# Altium project PDM_v1.0.PrjPcb
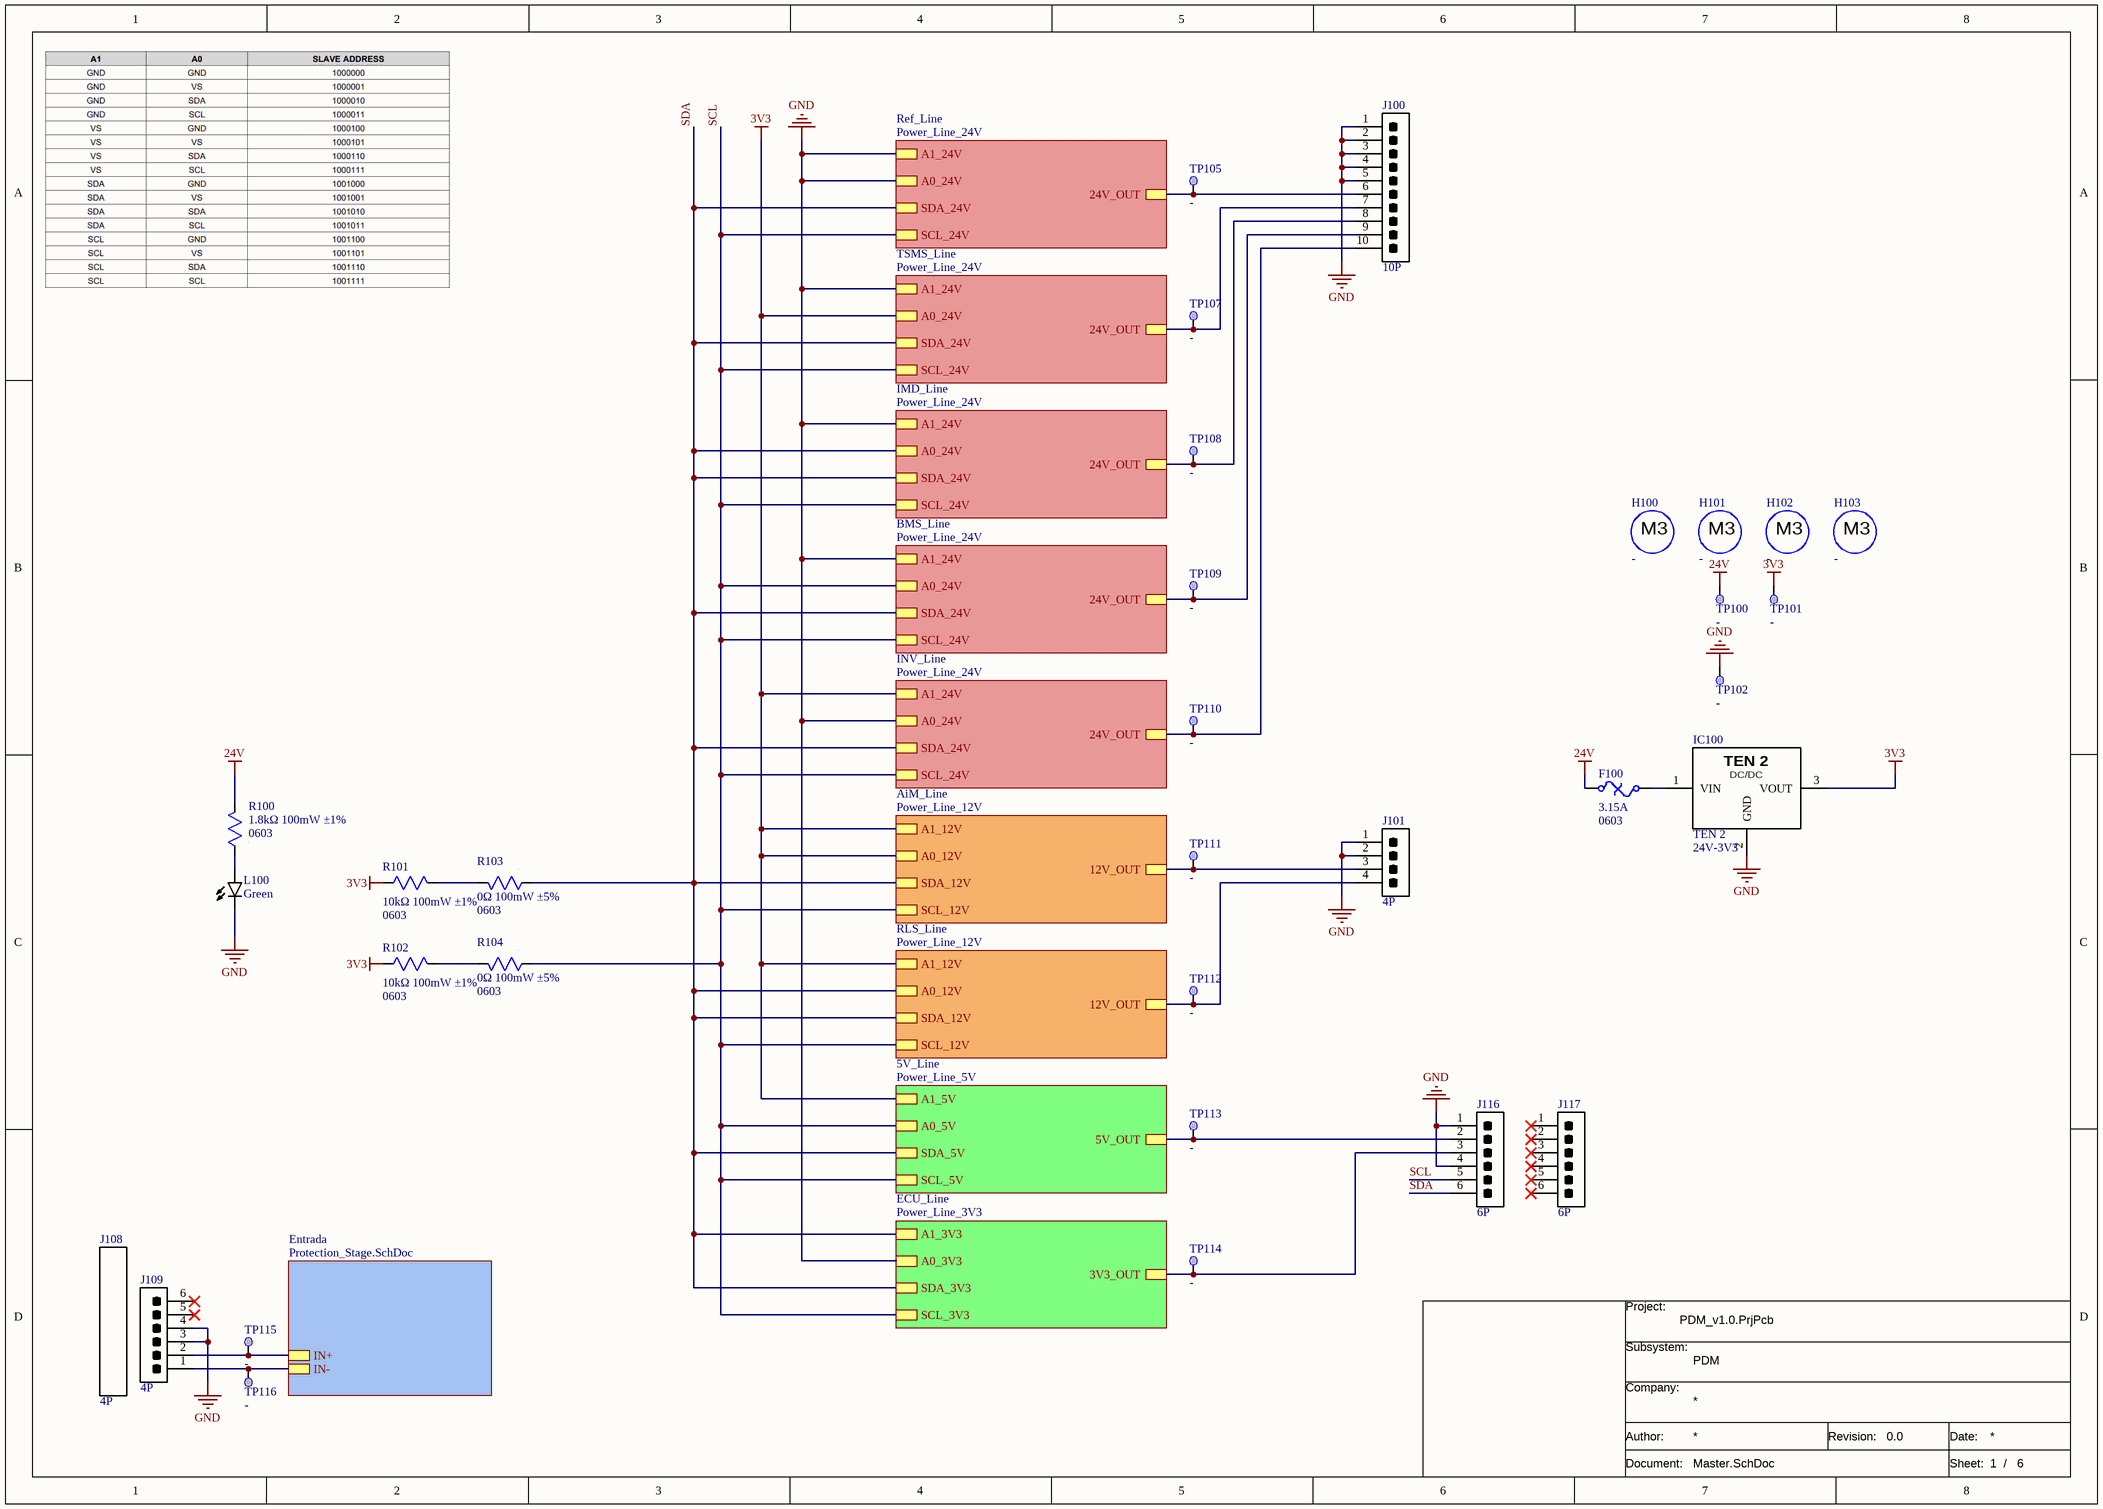
[diagram p0: Master.SchDoc]
Author: eUSRacing; Date: 07/04/2026; Project: PDM; Revision: 0.0
6 sheets, 174 parts. Net scope: hierarchical (ports join the sheet entries above them; power ports are global).
Board file: PDM.PcbDoc
Sheets:
  Master.SchDoc
    ECU_Line = Power_Line_3V3.SchDoc
    5V_Line = Power_Line_5V.SchDoc
    RLS_Line = Power_Line_12V.SchDoc
    AiM_Line = Power_Line_12V.SchDoc
    Ref_Line = Power_Line_24V.SchDoc
    IMD_Line = Power_Line_24V.SchDoc
    BMS_Line = Power_Line_24V.SchDoc
    INV_Line = Power_Line_24V.SchDoc
    Entrada = Protection_Stage.SchDoc
    TSMS_Line = Power_Line_24V.SchDoc

## Sheet Master.SchDoc: PDM
size A3; SheetNumber: 1; SheetTotal: 6

### Parts
F100  value 3.15A  Package: 0603  [FUSE SMD 0603]  (hidden comment: FUSE)
H100  SCREW M3  [M3]  (value not drawn)
H101  SCREW M3  [M3]  (value not drawn)
H102  SCREW M3  [M3]  (value not drawn)
H103  SCREW M3  [M3]  (value not drawn)
IC100  TEN 2  value 24V-3V3  [TEN 2]
J100  value 10P  [657010240101]  (hidden comment: CONN 10P)
J101  value 4P  [657004240101]  (hidden comment: CONN 4P)
J108  value 4P  [657004150201]  (hidden comment: AEREO)
J109  value 4P  [657004140101]  (hidden comment: CONN 6P)
J116  value 6P  [HEADERS_MALE_6P_2.54MM]  (hidden comment: CONN 6P)
J117  value 6P  [HEADERS_MALE_6P_2.54MM]  (hidden comment: CONN 6P)
L100  value Green  [LED SMD 0603]  (hidden comment: LED WHITE)
R100  value 1.8kΩ 100mW ±1%  Package: 0603  [RES SMD 0603]  (hidden comment: RES)
R101  value 10kΩ 100mW ±1%  Package: 0603  [RES SMD 0603]  (hidden comment: RES)
R102  value 10kΩ 100mW ±1%  Package: 0603  [RES SMD 0603]  (hidden comment: RES)
R103  value 0Ω 100mW ±5%  Package: 0603  [RES SMD 0603]  (hidden comment: RES)
R104  value 0Ω 100mW ±5%  Package: 0603  [RES SMD 0603]  (hidden comment: RES)
TP100  Test Point  [TP_SMD_1MM]  (value not drawn)  (no BOM)
TP101  Test Point  [TP_SMD_1MM]  (value not drawn)  (no BOM)
TP102  Test Point  [TP_SMD_1MM]  (value not drawn)  (no BOM)
TP105  Test Point  [TP_SMD_1MM]  (value not drawn)  (no BOM)
TP107  Test Point  [TP_SMD_1MM]  (value not drawn)  (no BOM)
TP108  Test Point  [TP_SMD_1MM]  (value not drawn)  (no BOM)
TP109  Test Point  [TP_SMD_1MM]  (value not drawn)  (no BOM)
TP110  Test Point  [TP_SMD_1MM]  (value not drawn)  (no BOM)
TP111  Test Point  [TP_SMD_1MM]  (value not drawn)  (no BOM)
TP112  Test Point  [TP_SMD_1MM]  (value not drawn)  (no BOM)
TP113  Test Point  [TP_SMD_1MM]  (value not drawn)  (no BOM)
TP114  Test Point  [TP_SMD_1MM]  (value not drawn)  (no BOM)
TP115  Test Point  [TP_SMD_1MM]  (value not drawn)  (no BOM)
TP116  Test Point  [TP_SMD_1MM]  (value not drawn)  (no BOM)

### Sub-sheets
5V_Line = Power_Line_5V: 5V_OUT, A1_5V, A0_5V, SDA_5V, SCL_5V
AiM_Line = Power_Line_12V: 12V_OUT, A1_12V, A0_12V, SDA_12V, SCL_12V
BMS_Line = Power_Line_24V: A1_24V, A0_24V, SDA_24V, SCL_24V, 24V_OUT
ECU_Line = Power_Line_3V3: 3V3_OUT, A1_3V3, A0_3V3, SDA_3V3, SCL_3V3
Entrada = Protection_Stage.SchDoc: IN-, IN+
IMD_Line = Power_Line_24V: A1_24V, A0_24V, SDA_24V, SCL_24V, 24V_OUT
INV_Line = Power_Line_24V: A1_24V, A0_24V, SDA_24V, SCL_24V, 24V_OUT
Ref_Line = Power_Line_24V: A1_24V, A0_24V, SDA_24V, SCL_24V, 24V_OUT
RLS_Line = Power_Line_12V: 12V_OUT, A1_12V, A0_12V, SDA_12V, SCL_12V
TSMS_Line = Power_Line_24V: A1_24V, A0_24V, SDA_24V, SCL_24V, 24V_OUT

### Nets
3V3: IC100.3(VOUT) R101.1 R102.1 TP101.1 ; sheet 5V_Line/A1_5V, sheet RLS_Line/A1_12V, sheet AiM_Line/A1_12V, sheet AiM_Line/A0_12V, sheet INV_Line/A1_24V, sheet TSMS_Line/A0_24V
24V: F100.1 R100.2 TP100.1
GND: IC100.2(GND) J100.1 J100.2 J100.3 J100.4 J100.5 J101.1 J101.2 J109.3 J109.4 J116.1 J116.4 L100.C TP102.1 ; sheet ECU_Line/A0_3V3, sheet Ref_Line/A1_24V, sheet Ref_Line/A0_24V, sheet IMD_Line/A1_24V, sheet BMS_Line/A1_24V, sheet INV_Line/A0_24V, sheet TSMS_Line/A1_24V
3V3_OUT: J116.3 TP114.1 ; sheet ECU_Line/3V3_OUT
5V_OUT: J116.2 TP113.1 ; sheet 5V_Line/5V_OUT
12V_OUT: J101.3 TP111.1 ; sheet AiM_Line/12V_OUT
12V_OUT: J101.4 TP112.1 ; sheet RLS_Line/12V_OUT  [a separate net that carries the same name]
24V_OUT: J100.6 TP105.1 ; sheet Ref_Line/24V_OUT
24V_OUT: J100.7 TP107.1 ; sheet TSMS_Line/24V_OUT  [a separate net that carries the same name]
24V_OUT: J100.8 TP108.1 ; sheet IMD_Line/24V_OUT  [a separate net that carries the same name]
24V_OUT: J100.9 TP109.1 ; sheet BMS_Line/24V_OUT  [a separate net that carries the same name]
24V_OUT: J100.10 TP110.1 ; sheet INV_Line/24V_OUT  [a separate net that carries the same name]
IN+: J109.2 TP115.1 ; sheet Entrada/IN+
IN-: J109.1 TP116.1 ; sheet Entrada/IN-
SCL: J116.5 R104.1 ; sheet ECU_Line/SCL_3V3, sheet 5V_Line/A0_5V, sheet 5V_Line/SCL_5V, sheet RLS_Line/SCL_12V, sheet AiM_Line/SCL_12V, sheet Ref_Line/SCL_24V, sheet IMD_Line/SCL_24V, sheet BMS_Line/A0_24V, sheet BMS_Line/SCL_24V, sheet INV_Line/SCL_24V, sheet TSMS_Line/SCL_24V
SDA: J116.6 R103.1 ; sheet ECU_Line/A1_3V3, sheet ECU_Line/SDA_3V3, sheet 5V_Line/SDA_5V, sheet RLS_Line/A0_12V, sheet RLS_Line/SDA_12V, sheet AiM_Line/SDA_12V, sheet Ref_Line/SDA_24V, sheet IMD_Line/A0_24V, sheet IMD_Line/SDA_24V, sheet BMS_Line/SDA_24V, sheet INV_Line/SDA_24V, sheet TSMS_Line/SDA_24V
NetF100_2: F100.2 IC100.1(VIN)
NetL100_A: L100.A R100.1
NetR101_2: R101.2 R103.2
NetR102_2: R102.2 R104.2

Not connected (* = marked no-connect by the designer): J109 5* 6*; J117 1* 2* 3* 4* 5* 6*

### Notes on the sheet
- Project:
- Subsystem:
- Company:
- Document:
- Author:
- Revision:
- Date:
- Sheet:
- /
- (in symbol 070-0001) DC/DC
- (in symbol 100-0002) M3

### Library data of the parts
F100 = 040-0025: Surface Mount Fuses 3.15A Slow Blow 0603 SinglFuse; MPN: SF-0603S315-2; Manufacturer: Bourns; ComponentLink1Description: Datasheet; ComponentLink1URL: https://www.mouser.es/datasheet/3/40/1/sf0603s.pdf; ComponentLink2Description: Distributor Link; ComponentLink2URL: https://www.mouser.es/en/ProductDetail/Bourns/SF-0603S315-2?qs=GIQXYiEeHGBW8r%252BkbDjk9Q%3D%3D; ID: 040-0025; Distributor PN: 652-SF-0603S315-2; Distributor: Mouser
H100-H103 = 100-0002: M3 Screw; ComponentLink1Description: Datasheet; ComponentLink1URL: -; ComponentLink2Description: Distributor Link; ComponentLink2URL: -; ID: 100-0002; Value: -; Package: -; MPN: -; Manufacturer: -; Distributor PN: -; Distributor: -
IC100 = 070-0001: Convertidores DC/DC para montaje pasante 4.75-36Vin 3.3V 2A switching regulator; MPN: TSR 2-2433; Manufacturer: TRACO Power; ComponentLink1Description: Datasheet; ComponentLink1URL: https://www.tracopower.com/tsr2-datasheet; ComponentLink2Description: Distributor Link; ComponentLink2URL: https://www.mouser.es/ProductDetail/TRACO-Power/TSR-2-2433?qs=NtE2QagKf6Qer8edccxn%2FA%3D%3D; ID: 070-0001; Package: 14.0x7.5x10.1mm; Distributor PN: 495-TSR2-2433; Distributor: Mouser
J100 = 110-0069: Headers & Wire Housings WR-MPC5 THT Dual Row Male Header Right Angled with Snap-in Plastic Pegs Glow-Wire 10 Pins; Manufacturer: Wurth Elektronik; ComponentLink1Description: Datasheet; ComponentLink1URL: https://www.we-online.com/components/products/datasheet/657010240101.pdf; ComponentLink2Description: Distributor Link; ComponentLink2URL: https://www.mouser.es/en/ProductDetail/Wurth-Elektronik/657010240101?qs=Z%252BL2brAPG1L7pimSXLZIOg%3D%3D; ID: 110-0069; Package: THT 5,7mm; MPN: 657010240101; Distributor PN: 710-657010240101; Distributor: Mouser
J101 = 110-0070: Headers & Wire Housings WR-MPC5 THT Dual Row Male Header Right Angled with Snap-in Plastic Pegs Glow-Wire 4 Pins; Manufacturer: Wurth Elektronik; ComponentLink1Description: Datasheet; ComponentLink1URL: https://www.we-online.com/components/products/datasheet/657004240101.pdf; ComponentLink2Description: Distributor Link; ComponentLink2URL: https://www.mouser.es/en/ProductDetail/Wurth-Elektronik/657004240101?qs=Z%252BL2brAPG1IceqvpwioElw%3D%3D; ID: 110-0070; Package: THT 5,7mm; MPN: 657004240101; Distributor PN: 710-657004240101; Distributor: Mouser
J108 = 110-0060: Receptacle Single Row; Manufacturer: Wurth Elektronik; ComponentLink1Description: Datasheet; ComponentLink1URL: https://www.we-online.com/components/products/datasheet/657004150201.pdf; ComponentLink2Description: Distributor Link; ComponentLink2URL: https://www.we-online.com/en/components/products/WTB_WR_MPC5_RECEPTACLE_PLUG_SINGLE_ROW#/articles/WTB_WR_MPC5_SINGLE_ROW_RECEPTACLE_HOUSING; ID: 110-0060; Package: THT 5,7mm; MPN: 657004150201; Distributor PN: 657004150201; Distributor: Wurth Elektronik
J109 = 110-0059: WR-MPC5 Male Header Single Row; Manufacturer: Wurth Elektronik; ComponentLink1Description: Datasheet; ComponentLink1URL: https://www.we-online.com/components/products/datasheet/657004140101.pdf; ComponentLink2Description: Distributor Link; ComponentLink2URL: https://www.we-online.com/en/components/products/WTB_WR_MPC5_SINGLE_ROW; ID: 110-0059; Package: THT 5,7mm; MPN: 657004140101; Distributor PN: 657004140101; Distributor: Wurth Elektronik
J116 J117 = 110-0050: Pin Header 6 Position 2.54mm Pitch Single Row Through Hole -55℃~+105℃; MPN: 2541WV-06P; Manufacturer: HanElectricity; ComponentLink1Description: Datasheet; ComponentLink1URL: https://www.lcsc.com/datasheet/C5383115.pdf; ComponentLink2Description: Distributor Link; ComponentLink2URL: https://www.lcsc.com/product-detail/C5383115.html; ID: 110-0050; Package: THT 2,54mm; Distributor PN: C5383115; Distributor: LCSC
L100 = 033-0023: LED de un solo color Green 525nm 1400mcd 2.85V 73deg 0603; MPN: VLMTG1400-GS08; Manufacturer: Vishay Semiconductors; ComponentLink1Description: Datasheet; ComponentLink1URL: https://www.vishay.com/docs/84393/vlmtg1400.pdf; ComponentLink2Description: Distributor Link; ComponentLink2URL: https://www.mouser.es/ProductDetail/Vishay-Semiconductors/VLMTG1400-GS08?qs=gt1LBUVyoHlZ6yHd8iEIzQ%3D%3D; ID: 033-0023; Package: 0603; Distributor PN: 78-VLMTG1400-GS08; Distributor: Mouser
R100 = 010-0146: Resistores de película gruesa - SMD WRIS-RSKS 1.8 kOhms 1 % 0.1 W 0603 AEC-Q200; MPN: 560112116032; Manufacturer: Wurth Elektronik; ComponentLink1Description: Datasheet; ComponentLink1URL: https://www.we-online.com/components/products/datasheet/560112116032.pdf; ComponentLink2Description: Distributor Link; ComponentLink2URL: https://www.mouser.es/ProductDetail/Wurth-Elektronik/560112116032?qs=mELouGlnn3dPZZEXKb4zAQ%3D%3D; ID: 010-0146; Distributor PN: 710-560112116032; Distributor: Mouser
R101 R102 = 010-0145: Resistores de película gruesa - SMD WRIS-RSKS 10 kOhms 1 % 0.1 W 0603 AEC-Q200; MPN: 560112116005; Manufacturer: Wurth Elektronik; ComponentLink1Description: Datasheet; ComponentLink1URL: https://www.we-online.com/components/products/datasheet/560112116005.pdf; ComponentLink2Description: Distributor Link; ComponentLink2URL: https://www.mouser.es/ProductDetail/Wurth-Elektronik/560112116005?qs=mELouGlnn3dMVSPHwBGouA%3D%3D; ID: 010-0145; Distributor PN: 710-560112116005; Distributor: Mouser
R103 R104 = 010-0142: Resistores de película gruesa - SMD WRIS-RSKS <0.05 Ohms 0.1 W Jumper 0603 AEC-Q200; MPN: 560112116001; Manufacturer: Wurth Elektronik; ComponentLink1Description: Datasheet; ComponentLink1URL: https://www.we-online.com/components/products/datasheet/560112116001.pdf; ComponentLink2Description: Distributor Link; ComponentLink2URL: https://www.mouser.es/ProductDetail/Wurth-Elektronik/560112116001?qs=mELouGlnn3dlnHYj7TecuA%3D%3D; ID: 010-0142; Distributor PN: 710-560112116001; Distributor: Mouser
TP100-TP102 TP105 TP107-TP116 = 110-0007: ComponentLink1URL: -; ComponentLink1Description: Datasheet; ComponentLink1URL: *; ComponentLink2Description: Distributor Link; ComponentLink2URL: -; ID: 110-0007; Value: -; Package: -; MPN: -; Manufacturer: -; Distributor PN: -; Distributor: -

## Sheet Power_Line_3V3.SchDoc: PDM
size A3; SheetNumber: 2; SheetTotal: 6
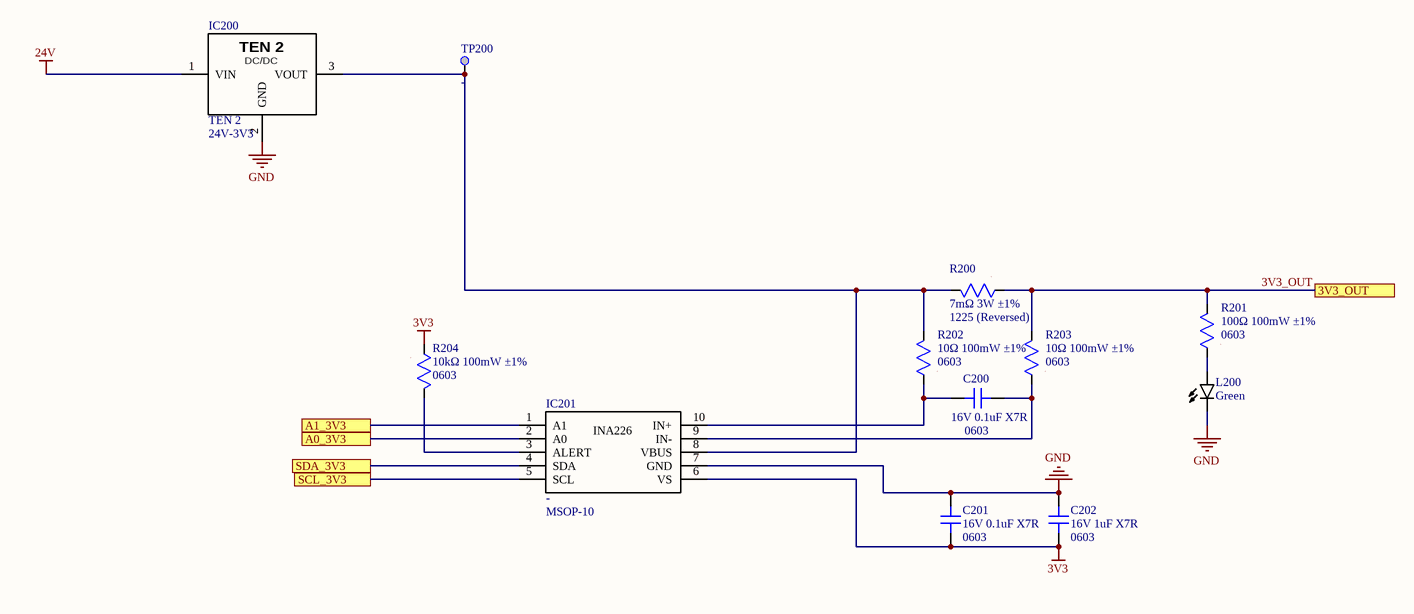
[diagram p1: Power_Line_3V3.SchDoc]

### Parts
C200  value 16V 0.1uF X7R  Package: 0603  [CAP SMD 0603]  (hidden comment: CAP non polarized)
C201  value 16V 0.1uF X7R  Package: 0603  [CAP SMD 0603]  (hidden comment: CAP non polarized)
C202  value 16V 1uF X7R  Package: 0603  [CAP SMD 0603]  (hidden comment: CAP non polarized)
IC200  TEN 2  value 24V-3V3  [TEN 2]
IC201  Package: MSOP-10  [VSOP-10]  (hidden comment: INA226)
L200  value Green  [LED SMD 0603]  (hidden comment: LED WHITE)
R200  value 7mΩ 3W ±1%  Package: 1225 (Reversed)  [RES SMD 1225 Reversed]  (hidden comment: RES)
R201  value 100Ω 100mW ±1%  Package: 0603  [RES SMD 0603]  (hidden comment: RES)
R202  value 10Ω 100mW ±1%  Package: 0603  [RES SMD 0603]  (hidden comment: RES)
R203  value 10Ω 100mW ±1%  Package: 0603  [RES SMD 0603]  (hidden comment: RES)
R204  value 10kΩ 100mW ±1%  Package: 0603  [RES SMD 0603]  (hidden comment: RES)
TP200  Test Point  [TP_SMD_1MM]  (value not drawn)  (no BOM)

### Ports
3V3_OUT, A0_3V3, A1_3V3, SCL_3V3, SDA_3V3

### Nets
3V3: C201.2 C202.2 IC201.6(VS) R204.1
24V: IC200.1(VIN)
GND: C201.1 C202.1 IC200.2(GND) IC201.2(A0) IC201.7(GND) L200.C ; port A0_3V3
3V3_OUT: R200.1 R201.2 R203.2 ; port 3V3_OUT
SCL: IC201.5(SCL) ; port SCL_3V3
SDA: IC201.1(A1) IC201.4(SDA) ; port A1_3V3, port SDA_3V3
NetC200_1: C200.1 IC201.10(IN+) R202.1
NetC200_2: C200.2 IC201.9(IN-) R203.1
NetIC200_3: IC200.3(VOUT) IC201.8(VBUS) R200.2 R202.2 TP200.1
NetIC201_3: IC201.3(ALERT) R204.2
NetL200_A: L200.A R201.1

### Notes on the sheet
- Project:
- Subsystem:
- Company:
- Document:
- Author:
- Revision:
- Date:
- Sheet:
- /
- (in symbol 070-0001) DC/DC

### Library data of the parts
C200 C201 = 001-0112: Condensadores de cerámica multicapa (MLCC- SMD/SMT) WCAP-CSGP 0.1uF 0603 10% 16V MLCC; MPN: 885012206046; Manufacturer: Wurth Elektronik; ComponentLink1Description: Datasheet; ComponentLink1URL: https://www.we-online.com/components/products/datasheet/885012206046.pdf; ComponentLink2Description: Distributor Link; ComponentLink2URL: https://www.mouser.es/ProductDetail/Wurth-Elektronik/885012206046?qs=0KOYDY2FL2%252B89gr6HvTBXA%3D%3D; ID: 001-0112; Distributor PN: 710-885012206046; Distributor: Mouser
C202 = 001-0110: Condensadores de cerámica multicapa (MLCC- SMD/SMT) WCAP-CSGP 1uF 0603 10% 16V MLCC; MPN: 885012206052; Manufacturer: Wurth Elektronik; ComponentLink1Description: Datasheet; ComponentLink1URL: https://www.we-online.com/components/products/datasheet/885012206052.pdf; ComponentLink2Description: Distributor Link; ComponentLink2URL: https://www.mouser.es/ProductDetail/Wurth-Elektronik/885012206052?qs=0KOYDY2FL2%2F2JKabApojcQ%3D%3D; ID: 001-0110; Distributor PN: 710-885012206052; Distributor: Mouser
IC200 = 070-0001: as IC100 on sheet Master; ComponentLink1Description: Datasheet; ComponentLink1URL: https://www.tracopower.com/tsr2-datasheet; ComponentLink2Description: Distributor Link; ComponentLink2URL: https://www.mouser.es/ProductDetail/TRACO-Power/TSR-2-2433?qs=NtE2QagKf6Qer8edccxn%2FA%3D%3D; ID: 070-0001; Package: 14.0x7.5x10.1mm; Distributor PN: 495-TSR2-2433; Distributor: Mouser
IC201 = 050-0001: Monitores y reguladores de corriente y energía Hi-Side Msmt Bi-Dir Current/Pwr Mon A 59 A 595-INA226AIDGST; MPN: INA226AIDGSR; Manufacturer: 595-INA226AIDGSR; ComponentLink1Description: Datasheet; ComponentLink1URL: https://www.ti.com/lit/ds/symlink/ina226.pdf?ts=1772078114731&ref_url=https%253A%252F%252Fwww.ti.com%252Fproduct%252FINA226; ComponentLink2Description: Distributor Link; ComponentLink2URL: https://www.mouser.es/ProductDetail/Texas-Instruments/INA226AIDGSR?qs=tQG3bEuiOZD4quG3egR36g%3D%3D&srsltid=AfmBOopOjh8KVXQVeHwZlO8DxeOetC6-xgaoNkKslHEV4iGJ_SkIIo7K; ID: 050-0001; Value: -; Distributor PN: Texas Instruments; Distributor: Mouser
L200 = 033-0023: as L100 on sheet Master; ComponentLink1Description: Datasheet; ComponentLink1URL: https://www.vishay.com/docs/84393/vlmtg1400.pdf; ComponentLink2Description: Distributor Link; ComponentLink2URL: https://www.mouser.es/ProductDetail/Vishay-Semiconductors/VLMTG1400-GS08?qs=gt1LBUVyoHlZ6yHd8iEIzQ%3D%3D; ID: 033-0023; Package: 0603; Distributor PN: 78-VLMTG1400-GS08; Distributor: Mouser
R200 = 015-0003: Resistores de detección de corriente - SMD 3W 0.007ohm 1% 50ppm; MPN: KRL6432E-M-R007-F-T1; Manufacturer: Susumu; ComponentLink1Description: Datasheet; ComponentLink1URL: https://www.mouser.es/datasheet/3/826/1/n_catalog_partition19_en.pdf; ComponentLink2Description: Distributor Link; ComponentLink2URL: https://www.mouser.es/ProductDetail/Susumu/KRL6432E-M-R007-F-T1?qs=FG09h9tFCuA5fgBuyupdEw%3D%3D; ID: 015-0003; Distributor PN: 754-KRL6432EMR007FT1; Distributor: Mouser
R201 = 010-0172: Thick Film Resistors WRIS-RSKS 100 Ohms 1 % 0.1 W 0603 AEC-Q200; MPN: 560112116009; Manufacturer: Wurth Elektronik; ComponentLink1Description: Datasheet; ComponentLink1URL: https://www.we-online.com/components/products/datasheet/560112116009.pdf; ComponentLink2Description: Distributor Link; ComponentLink2URL: https://www.mouser.es/ProductDetail/Wurth-Elektronik/560112116009?qs=sGAEpiMZZMvdGkrng054txLI%2FDB4oIKDTCqaE%2Fpesdwv2JWXHdCmlQ%3D%3D; ID: 010-0172; Distributor PN: 710-560112116009; Distributor: Mouser
R202 R203 = 010-0149: Resistores de película gruesa - SMD WRIS-RSKS 10 Ohms 1 % 0.1 W 0603 AEC-Q200; MPN: 560112116013; Manufacturer: Wurth Elektronik; ComponentLink1Description: Datasheet; ComponentLink1URL: https://www.we-online.com/components/products/datasheet/560112116013.pdf; ComponentLink2Description: Distributor Link; ComponentLink2URL: https://www.mouser.es/ProductDetail/Wurth-Elektronik/560112116013?qs=mELouGlnn3f7quibYlpocQ%3D%3D; ID: 010-0149; Distributor PN: 710-560112116013; Distributor: Mouser
R204 = 010-0145: as R101 on sheet Master; ComponentLink1Description: Datasheet; ComponentLink1URL: https://www.we-online.com/components/products/datasheet/560112116005.pdf; ComponentLink2Description: Distributor Link; ComponentLink2URL: https://www.mouser.es/ProductDetail/Wurth-Elektronik/560112116005?qs=mELouGlnn3dMVSPHwBGouA%3D%3D; ID: 010-0145; Distributor PN: 710-560112116005; Distributor: Mouser
TP200 = 110-0007: ComponentLink1URL: -; ComponentLink1Description: Datasheet; ComponentLink1URL: *; ComponentLink2Description: Distributor Link; ComponentLink2URL: -; ID: 110-0007; Value: -; Package: -; MPN: -; Manufacturer: -; Distributor PN: -; Distributor: -

## Sheet Power_Line_5V.SchDoc: PDM
size A3; SheetNumber: 3; SheetTotal: 6
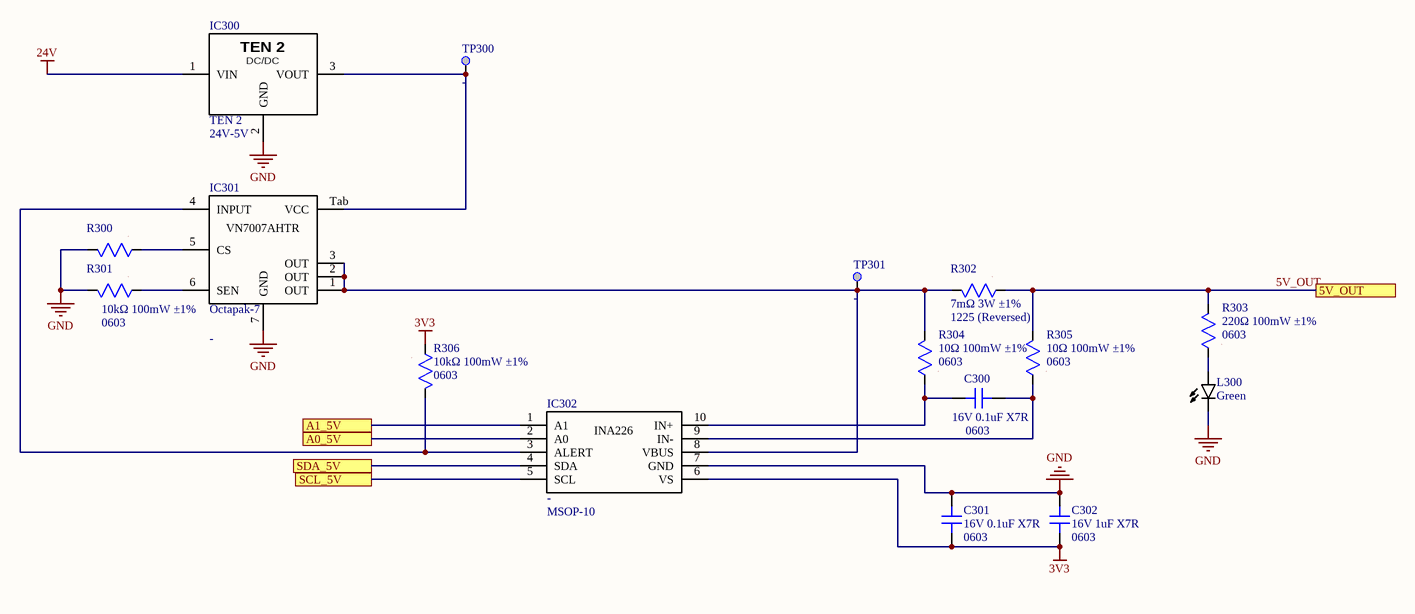
[diagram p2: Power_Line_5V.SchDoc]

### Parts
C300  value 16V 0.1uF X7R  Package: 0603  [CAP SMD 0603]  (hidden comment: CAP non polarized)
C301  value 16V 0.1uF X7R  Package: 0603  [CAP SMD 0603]  (hidden comment: CAP non polarized)
C302  value 16V 1uF X7R  Package: 0603  [CAP SMD 0603]  (hidden comment: CAP non polarized)
IC300  TEN 2  value 24V-5V  [TEN 2]
IC301  VN7007AHTR  [Octapak-7]  (value not drawn)
IC302  Package: MSOP-10  [VSOP-10]  (hidden comment: INA226)
L300  value Green  [LED SMD 0603]  (hidden comment: LED WHITE)
R300  RES  [RES SMD 0603]  (value not drawn)
R301  value 10kΩ 100mW ±1%  Package: 0603  [RES SMD 0603]  (hidden comment: RES)
R302  value 7mΩ 3W ±1%  Package: 1225 (Reversed)  [RES SMD 1225 Reversed]  (hidden comment: RES)
R303  value 220Ω 100mW ±1%  Package: 0603  [RES SMD 0603]  (hidden comment: RES)
R304  value 10Ω 100mW ±1%  Package: 0603  [RES SMD 0603]  (hidden comment: RES)
R305  value 10Ω 100mW ±1%  Package: 0603  [RES SMD 0603]  (hidden comment: RES)
R306  value 10kΩ 100mW ±1%  Package: 0603  [RES SMD 0603]  (hidden comment: RES)
TP300  Test Point  [TP_SMD_1MM]  (value not drawn)  (no BOM)
TP301  Test Point  [TP_SMD_1MM]  (value not drawn)  (no BOM)

### Ports
5V_OUT, A0_5V, A1_5V, SCL_5V, SDA_5V

### Nets
3V3: C301.2 C302.2 IC302.1(A1) IC302.6(VS) R306.1 ; port A1_5V
24V: IC300.1(VIN)
GND: C301.1 C302.1 IC300.2(GND) IC301.7(GND) IC302.7(GND) L300.C R300.2 R301.2
5V_OUT: R302.1 R303.2 R305.2 ; port 5V_OUT
SCL: IC302.2(A0) IC302.5(SCL) ; port A0_5V, port SCL_5V
SDA: IC302.4(SDA) ; port SDA_5V
NetC300_1: C300.1 IC302.10(IN+) R304.1
NetC300_2: C300.2 IC302.9(IN-) R305.1
NetIC300_3: IC300.3(VOUT) IC301.Tab(VCC) TP300.1
NetIC301_1: IC301.1(OUT) IC301.2(OUT) IC301.3(OUT) IC302.8(VBUS) R302.2 R304.2 TP301.1
NetIC301_4: IC301.4(INPUT) IC302.3(ALERT) R306.2
NetIC301_5: IC301.5(CS) R300.1
NetIC301_6: IC301.6(SEN) R301.1
NetL300_A: L300.A R303.1

### Notes on the sheet
- Project:
- Subsystem:
- Company:
- Document:
- Author:
- Revision:
- Date:
- Sheet:
- /
- (in symbol 070-0002) DC/DC

### Library data of the parts
C300 C301 = 001-0112: as C200 on sheet Power_Line_3V3; ComponentLink1Description: Datasheet; ComponentLink1URL: https://www.we-online.com/components/products/datasheet/885012206046.pdf; ComponentLink2Description: Distributor Link; ComponentLink2URL: https://www.mouser.es/ProductDetail/Wurth-Elektronik/885012206046?qs=0KOYDY2FL2%252B89gr6HvTBXA%3D%3D; ID: 001-0112; Distributor PN: 710-885012206046; Distributor: Mouser
C302 = 001-0110: as C202 on sheet Power_Line_3V3; ComponentLink1Description: Datasheet; ComponentLink1URL: https://www.we-online.com/components/products/datasheet/885012206052.pdf; ComponentLink2Description: Distributor Link; ComponentLink2URL: https://www.mouser.es/ProductDetail/Wurth-Elektronik/885012206052?qs=0KOYDY2FL2%2F2JKabApojcQ%3D%3D; ID: 001-0110; Distributor PN: 710-885012206052; Distributor: Mouser
IC300 = 070-0002: Convertidores DC/DC para montaje pasante 6.5-36Vin 5V 2A SIP switching regulator; MPN: TSR 2-2450; Manufacturer: TRACO Power; ComponentLink1Description: Datasheet; ComponentLink1URL: https://www.tracopower.com/tsr2-datasheet; ComponentLink2Description: Distributor Link; ComponentLink2URL: https://www.mouser.es/ProductDetail/TRACO-Power/TSR-2-2450?qs=NtE2QagKf6RzknAolzm%2FTQ%3D%3D; ID: 070-0002; Package: 14.0x7.5x10.1mm; Distributor PN: 495-TSR2-2450; Distributor: Mouser
IC301 = 050-0002: Controlador de puerta High side driver with current sense analog feedback for automotive applications; Manufacturer: 511-VN7007AHTR; ComponentLink1Description: Datasheet; ComponentLink1URL: https://www.st.com/resource/en/datasheet/vn7007ah.pdf; ComponentLink2Description: Distributor Link; ComponentLink2URL: https://www.mouser.es/ProductDetail/STMicroelectronics/VN7007AHTR?qs=mKNKSX85ZJecQmIqUrqpTA%3D%3D; ID: 050-0002; Value: -; Package: Octapak-7; MPN: VN7007AHTR; Distributor PN: STMicroelectronics; Distributor: Mouser
IC302 = 050-0001: as IC201 on sheet Power_Line_3V3; ComponentLink1Description: Datasheet; ComponentLink1URL: https://www.ti.com/lit/ds/symlink/ina226.pdf?ts=1772078114731&ref_url=https%253A%252F%252Fwww.ti.com%252Fproduct%252FINA226; ComponentLink2Description: Distributor Link; ComponentLink2URL: https://www.mouser.es/ProductDetail/Texas-Instruments/INA226AIDGSR?qs=tQG3bEuiOZD4quG3egR36g%3D%3D&srsltid=AfmBOopOjh8KVXQVeHwZlO8DxeOetC6-xgaoNkKslHEV4iGJ_SkIIo7K; ID: 050-0001; Value: -; Distributor PN: Texas Instruments; Distributor: Mouser
L300 = 033-0023: as L100 on sheet Master; ComponentLink1Description: Datasheet; ComponentLink1URL: https://www.vishay.com/docs/84393/vlmtg1400.pdf; ComponentLink2Description: Distributor Link; ComponentLink2URL: https://www.mouser.es/ProductDetail/Vishay-Semiconductors/VLMTG1400-GS08?qs=gt1LBUVyoHlZ6yHd8iEIzQ%3D%3D; ID: 033-0023; Package: 0603; Distributor PN: 78-VLMTG1400-GS08; Distributor: Mouser
R300 = 010-0145: Resistores de película gruesa - SMD WRIS-RSKS 10 kOhms 1 % 0.1 W 0603 AEC-Q200; MPN: 560112116005; Manufacturer: Wurth Elektronik; Value: 10kΩ 100mW ±1%; ComponentLink1Description: Datasheet; ComponentLink1URL: https://www.we-online.com/components/products/datasheet/560112116005.pdf; ComponentLink2Description: Distributor Link; ComponentLink2URL: https://www.mouser.es/ProductDetail/Wurth-Elektronik/560112116005?qs=mELouGlnn3dMVSPHwBGouA%3D%3D; Package: 0603; ID: 010-0145; Distributor PN: 710-560112116005; Distributor: Mouser
R301 R306 = 010-0145: as R101 on sheet Master; ComponentLink1Description: Datasheet; ComponentLink1URL: https://www.we-online.com/components/products/datasheet/560112116005.pdf; ComponentLink2Description: Distributor Link; ComponentLink2URL: https://www.mouser.es/ProductDetail/Wurth-Elektronik/560112116005?qs=mELouGlnn3dMVSPHwBGouA%3D%3D; ID: 010-0145; Distributor PN: 710-560112116005; Distributor: Mouser
R302 = 015-0003: as R200 on sheet Power_Line_3V3; ComponentLink1Description: Datasheet; ComponentLink1URL: https://www.mouser.es/datasheet/3/826/1/n_catalog_partition19_en.pdf; ComponentLink2Description: Distributor Link; ComponentLink2URL: https://www.mouser.es/ProductDetail/Susumu/KRL6432E-M-R007-F-T1?qs=FG09h9tFCuA5fgBuyupdEw%3D%3D; ID: 015-0003; Distributor PN: 754-KRL6432EMR007FT1; Distributor: Mouser
R303 = 010-0191: Resistores de película gruesa - SMD WRIS-RSKS 220 Ohms 1 % 0.1 W 0603 AEC-Q200; MPN: 560112116126; Manufacturer: Wurth Elektronik; ComponentLink1Description: Datasheet; ComponentLink1URL: https://www.we-online.com/components/products/datasheet/560112116126.pdf; ComponentLink2Description: Distributor Link; ID: 010-0191; Distributor PN: 710-560112116126; Distributor: Mouser
R304 R305 = 010-0149: as R202 on sheet Power_Line_3V3; ComponentLink1Description: Datasheet; ComponentLink1URL: https://www.we-online.com/components/products/datasheet/560112116013.pdf; ComponentLink2Description: Distributor Link; ComponentLink2URL: https://www.mouser.es/ProductDetail/Wurth-Elektronik/560112116013?qs=mELouGlnn3f7quibYlpocQ%3D%3D; ID: 010-0149; Distributor PN: 710-560112116013; Distributor: Mouser
TP300 TP301 = 110-0007: ComponentLink1URL: -; ComponentLink1Description: Datasheet; ComponentLink1URL: *; ComponentLink2Description: Distributor Link; ComponentLink2URL: -; ID: 110-0007; Value: -; Package: -; MPN: -; Manufacturer: -; Distributor PN: -; Distributor: -

## Sheet Power_Line_12V.SchDoc: PDM
size A3; SheetNumber: 4; SheetTotal: 6
Used 2 times, as channels RLS_Line, AiM_Line. Parts and nets are listed once, with the designators drawn on the sheet.
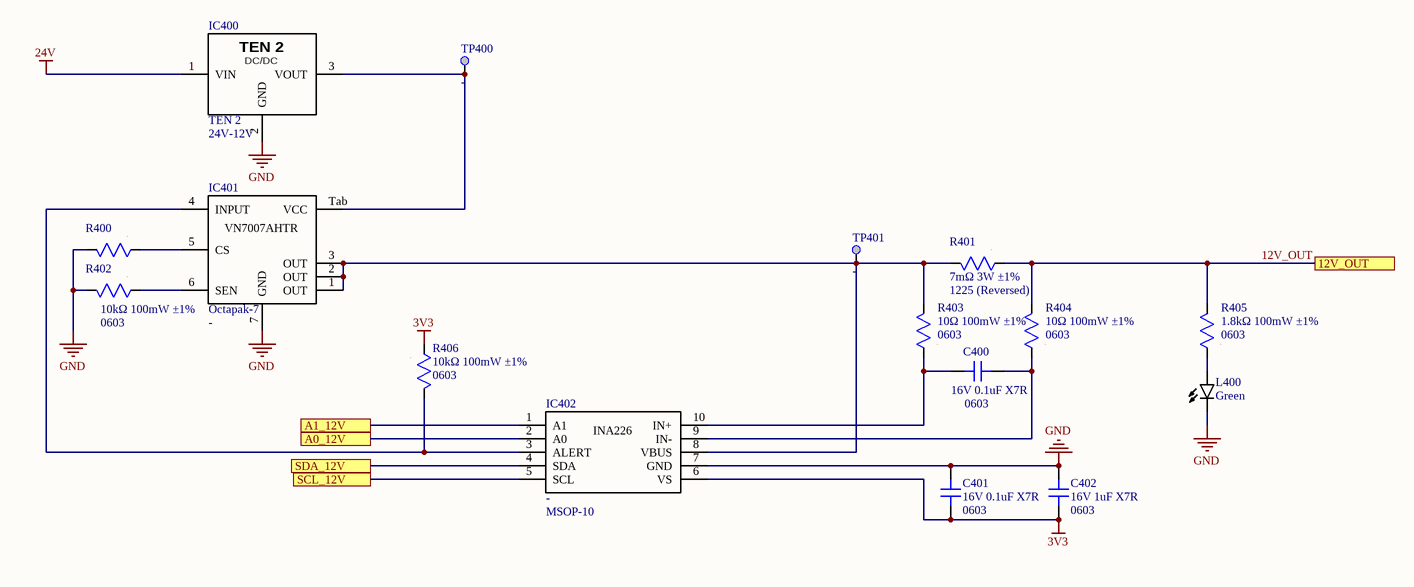
[diagram p3: Power_Line_12V.SchDoc]

### Parts
C400  value 16V 0.1uF X7R  Package: 0603  [CAP SMD 0603]  (hidden comment: CAP non polarized)
C401  value 16V 0.1uF X7R  Package: 0603  [CAP SMD 0603]  (hidden comment: CAP non polarized)
C402  value 16V 1uF X7R  Package: 0603  [CAP SMD 0603]  (hidden comment: CAP non polarized)
IC400  TEN 2  value 24V-12V  [TEN 2]
IC401  VN7007AHTR  [Octapak-7]  (value not drawn)
IC402  Package: MSOP-10  [VSOP-10]  (hidden comment: INA226)
L400  value Green  [LED SMD 0603]  (hidden comment: LED WHITE)
R400  RES  [RES SMD 0603]  (value not drawn)
R401  value 7mΩ 3W ±1%  Package: 1225 (Reversed)  [RES SMD 1225 Reversed]  (hidden comment: RES)
R402  value 10kΩ 100mW ±1%  Package: 0603  [RES SMD 0603]  (hidden comment: RES)
R403  value 10Ω 100mW ±1%  Package: 0603  [RES SMD 0603]  (hidden comment: RES)
R404  value 10Ω 100mW ±1%  Package: 0603  [RES SMD 0603]  (hidden comment: RES)
R405  value 1.8kΩ 100mW ±1%  Package: 0603  [RES SMD 0603]  (hidden comment: RES)
R406  value 10kΩ 100mW ±1%  Package: 0603  [RES SMD 0603]  (hidden comment: RES)
TP400  Test Point  [TP_SMD_1MM]  (value not drawn)  (no BOM)
TP401  Test Point  [TP_SMD_1MM]  (value not drawn)  (no BOM)

### Ports
12V_OUT, A0_12V, A1_12V, SCL_12V, SDA_12V

### Nets
3V3: C401.2 C402.2 IC402.6(VS) R406.1
24V: IC400.1(VIN)
GND: C401.1 C402.1 IC400.2(GND) IC401.7(GND) IC402.7(GND) L400.C R400.2 R402.2
12V_OUT: R401.1 R404.2 R405.2 ; port 12V_OUT
A0_12V: IC402.2(A0) ; port A0_12V
A1_12V: IC402.1(A1) ; port A1_12V
SCL_12V: IC402.5(SCL) ; port SCL_12V
SDA_12V: IC402.4(SDA) ; port SDA_12V
NetC400_1: C400.1 IC402.10(IN+) R403.1
NetC400_2: C400.2 IC402.9(IN-) R404.1
NetIC400_3: IC400.3(VOUT) IC401.Tab(VCC) TP400.1
NetIC401_1: IC401.1(OUT) IC401.2(OUT) IC401.3(OUT) IC402.8(VBUS) R401.2 R403.2 TP401.1
NetIC401_4: IC401.4(INPUT) IC402.3(ALERT) R406.2
NetIC401_5: IC401.5(CS) R400.1
NetIC401_6: IC401.6(SEN) R402.1
NetL400_A: L400.A R405.1

### Channels
RLS_Line: designators end in _RLS_Line; ports 12V_OUT=12V_OUT A0_12V=SDA A1_12V=3V3 SCL_12V=SCL SDA_12V=SDA
AiM_Line: designators end in _AiM_Line; ports 12V_OUT=12V_OUT A0_12V=3V3 A1_12V=3V3 SCL_12V=SCL SDA_12V=SDA

### Notes on the sheet
- Project:
- Subsystem:
- Company:
- Document:
- Author:
- Revision:
- Date:
- Sheet:
- /
- (in symbol 070-0003) DC/DC

### Library data of the parts
C400 C401 = 001-0112: as C200 on sheet Power_Line_3V3; ComponentLink1Description: Datasheet; ComponentLink1URL: https://www.we-online.com/components/products/datasheet/885012206046.pdf; ComponentLink2Description: Distributor Link; ComponentLink2URL: https://www.mouser.es/ProductDetail/Wurth-Elektronik/885012206046?qs=0KOYDY2FL2%252B89gr6HvTBXA%3D%3D; ID: 001-0112; Distributor PN: 710-885012206046; Distributor: Mouser
C402 = 001-0110: as C202 on sheet Power_Line_3V3; ComponentLink1Description: Datasheet; ComponentLink1URL: https://www.we-online.com/components/products/datasheet/885012206052.pdf; ComponentLink2Description: Distributor Link; ComponentLink2URL: https://www.mouser.es/ProductDetail/Wurth-Elektronik/885012206052?qs=0KOYDY2FL2%2F2JKabApojcQ%3D%3D; ID: 001-0110; Distributor PN: 710-885012206052; Distributor: Mouser
IC400 = 070-0003: Convertidores DC/DC para montaje pasante 15-36Vin 12V 2A SIP switching regulator; MPN: TSR 2-24120; Manufacturer: TRACO Power; ComponentLink1Description: Datasheet; ComponentLink1URL: https://www.tracopower.com/tsr2-datasheet; ComponentLink2Description: Distributor Link; ComponentLink2URL: https://www.mouser.es/ProductDetail/TRACO-Power/TSR-2-24120?qs=NtE2QagKf6T34HiGRDOLrw%3D%3D; ID: 070-0003; Package: 14.0x7.5x10.1mm; Distributor PN: 495-TSR2-24120; Distributor: Mouser
IC401 = 050-0002: as IC301 on sheet Power_Line_5V; ComponentLink1Description: Datasheet; ComponentLink1URL: https://www.st.com/resource/en/datasheet/vn7007ah.pdf; ComponentLink2Description: Distributor Link; ComponentLink2URL: https://www.mouser.es/ProductDetail/STMicroelectronics/VN7007AHTR?qs=mKNKSX85ZJecQmIqUrqpTA%3D%3D; ID: 050-0002; Value: -; Package: Octapak-7; MPN: VN7007AHTR; Distributor PN: STMicroelectronics; Distributor: Mouser
IC402 = 050-0001: as IC201 on sheet Power_Line_3V3; ComponentLink1Description: Datasheet; ComponentLink1URL: https://www.ti.com/lit/ds/symlink/ina226.pdf?ts=1772078114731&ref_url=https%253A%252F%252Fwww.ti.com%252Fproduct%252FINA226; ComponentLink2Description: Distributor Link; ComponentLink2URL: https://www.mouser.es/ProductDetail/Texas-Instruments/INA226AIDGSR?qs=tQG3bEuiOZD4quG3egR36g%3D%3D&srsltid=AfmBOopOjh8KVXQVeHwZlO8DxeOetC6-xgaoNkKslHEV4iGJ_SkIIo7K; ID: 050-0001; Value: -; Distributor PN: Texas Instruments; Distributor: Mouser
L400 = 033-0023: as L100 on sheet Master; ComponentLink1Description: Datasheet; ComponentLink1URL: https://www.vishay.com/docs/84393/vlmtg1400.pdf; ComponentLink2Description: Distributor Link; ComponentLink2URL: https://www.mouser.es/ProductDetail/Vishay-Semiconductors/VLMTG1400-GS08?qs=gt1LBUVyoHlZ6yHd8iEIzQ%3D%3D; ID: 033-0023; Package: 0603; Distributor PN: 78-VLMTG1400-GS08; Distributor: Mouser
R400 = 010-0145: as R300 on sheet Power_Line_5V; ComponentLink1Description: Datasheet; ComponentLink1URL: https://www.we-online.com/components/products/datasheet/560112116005.pdf; ComponentLink2Description: Distributor Link; ComponentLink2URL: https://www.mouser.es/ProductDetail/Wurth-Elektronik/560112116005?qs=mELouGlnn3dMVSPHwBGouA%3D%3D; Package: 0603; ID: 010-0145; Distributor PN: 710-560112116005; Distributor: Mouser
R401 = 015-0003: as R200 on sheet Power_Line_3V3; ComponentLink1Description: Datasheet; ComponentLink1URL: https://www.mouser.es/datasheet/3/826/1/n_catalog_partition19_en.pdf; ComponentLink2Description: Distributor Link; ComponentLink2URL: https://www.mouser.es/ProductDetail/Susumu/KRL6432E-M-R007-F-T1?qs=FG09h9tFCuA5fgBuyupdEw%3D%3D; ID: 015-0003; Distributor PN: 754-KRL6432EMR007FT1; Distributor: Mouser
R402 R406 = 010-0145: as R101 on sheet Master; ComponentLink1Description: Datasheet; ComponentLink1URL: https://www.we-online.com/components/products/datasheet/560112116005.pdf; ComponentLink2Description: Distributor Link; ComponentLink2URL: https://www.mouser.es/ProductDetail/Wurth-Elektronik/560112116005?qs=mELouGlnn3dMVSPHwBGouA%3D%3D; ID: 010-0145; Distributor PN: 710-560112116005; Distributor: Mouser
R403 R404 = 010-0149: as R202 on sheet Power_Line_3V3; ComponentLink1Description: Datasheet; ComponentLink1URL: https://www.we-online.com/components/products/datasheet/560112116013.pdf; ComponentLink2Description: Distributor Link; ComponentLink2URL: https://www.mouser.es/ProductDetail/Wurth-Elektronik/560112116013?qs=mELouGlnn3f7quibYlpocQ%3D%3D; ID: 010-0149; Distributor PN: 710-560112116013; Distributor: Mouser
R405 = 010-0146: as R100 on sheet Master; ComponentLink1Description: Datasheet; ComponentLink1URL: https://www.we-online.com/components/products/datasheet/560112116032.pdf; ComponentLink2Description: Distributor Link; ComponentLink2URL: https://www.mouser.es/ProductDetail/Wurth-Elektronik/560112116032?qs=mELouGlnn3dPZZEXKb4zAQ%3D%3D; ID: 010-0146; Distributor PN: 710-560112116032; Distributor: Mouser
TP400 TP401 = 110-0007: ComponentLink1URL: -; ComponentLink1Description: Datasheet; ComponentLink1URL: *; ComponentLink2Description: Distributor Link; ComponentLink2URL: -; ID: 110-0007; Value: -; Package: -; MPN: -; Manufacturer: -; Distributor PN: -; Distributor: -

## Sheet Power_Line_24V.SchDoc: PDM
size A3; SheetNumber: 5; SheetTotal: 6
Used 5 times, as channels Ref_Line, IMD_Line, BMS_Line, INV_Line, TSMS_Line. Parts and nets are listed once, with the designators drawn on the sheet.
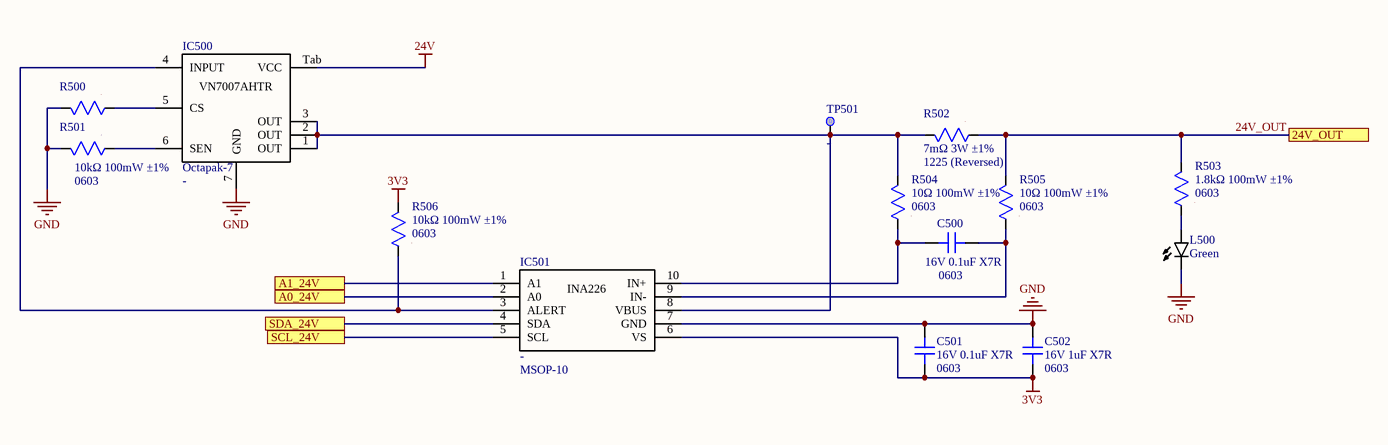
[diagram p4: Power_Line_24V.SchDoc]

### Parts
C500  value 16V 0.1uF X7R  Package: 0603  [CAP SMD 0603]  (hidden comment: CAP non polarized)
C501  value 16V 0.1uF X7R  Package: 0603  [CAP SMD 0603]  (hidden comment: CAP non polarized)
C502  value 16V 1uF X7R  Package: 0603  [CAP SMD 0603]  (hidden comment: CAP non polarized)
IC500  VN7007AHTR  [Octapak-7]  (value not drawn)
IC501  Package: MSOP-10  [VSOP-10]  (hidden comment: INA226)
L500  value Green  [LED SMD 0603]  (hidden comment: LED WHITE)
R500  RES  [RES SMD 0603]  (value not drawn)
R501  value 10kΩ 100mW ±1%  Package: 0603  [RES SMD 0603]  (hidden comment: RES)
R502  value 7mΩ 3W ±1%  Package: 1225 (Reversed)  [RES SMD 1225 Reversed]  (hidden comment: RES)
R503  value 1.8kΩ 100mW ±1%  Package: 0603  [RES SMD 0603]  (hidden comment: RES)
R504  value 10Ω 100mW ±1%  Package: 0603  [RES SMD 0603]  (hidden comment: RES)
R505  value 10Ω 100mW ±1%  Package: 0603  [RES SMD 0603]  (hidden comment: RES)
R506  value 10kΩ 100mW ±1%  Package: 0603  [RES SMD 0603]  (hidden comment: RES)
TP501  Test Point  [TP_SMD_1MM]  (value not drawn)  (no BOM)

### Ports
24V_OUT, A0_24V, A1_24V, SCL_24V, SDA_24V

### Nets
3V3: C501.2 C502.2 IC501.6(VS) R506.2
24V: IC500.Tab(VCC)
GND: C501.1 C502.1 IC500.7(GND) IC501.7(GND) L500.C R500.2 R501.2
24V_OUT: R502.1 R503.2 R505.2 ; port 24V_OUT
A0_24V: IC501.2(A0) ; port A0_24V
A1_24V: IC501.1(A1) ; port A1_24V
SCL_24V: IC501.5(SCL) ; port SCL_24V
SDA_24V: IC501.4(SDA) ; port SDA_24V
NetC500_1: C500.1 IC501.10(IN+) R504.1
NetC500_2: C500.2 IC501.9(IN-) R505.1
NetIC500_1: IC500.1(OUT) IC500.2(OUT) IC500.3(OUT) IC501.8(VBUS) R502.2 R504.2 TP501.1
NetIC500_4: IC500.4(INPUT) IC501.3(ALERT) R506.1
NetIC500_5: IC500.5(CS) R500.1
NetIC500_6: IC500.6(SEN) R501.1
NetL500_A: L500.A R503.1

### Channels
Ref_Line: designators end in _Ref_Line; ports 24V_OUT=24V_OUT A0_24V=GND A1_24V=GND SCL_24V=SCL SDA_24V=SDA
IMD_Line: designators end in _IMD_Line; ports 24V_OUT=24V_OUT A0_24V=SDA A1_24V=GND SCL_24V=SCL SDA_24V=SDA
BMS_Line: designators end in _BMS_Line; ports 24V_OUT=24V_OUT A0_24V=SCL A1_24V=GND SCL_24V=SCL SDA_24V=SDA
INV_Line: designators end in _INV_Line; ports 24V_OUT=24V_OUT A0_24V=GND A1_24V=3V3 SCL_24V=SCL SDA_24V=SDA
TSMS_Line: designators end in _TSMS_Line; ports 24V_OUT=24V_OUT A0_24V=3V3 A1_24V=GND SCL_24V=SCL SDA_24V=SDA

### Notes on the sheet
- Project:
- Subsystem:
- Company:
- Document:
- Author:
- Revision:
- Date:
- Sheet:
- /

### Library data of the parts
C500 C501 = 001-0112: as C200 on sheet Power_Line_3V3; ComponentLink1Description: Datasheet; ComponentLink1URL: https://www.we-online.com/components/products/datasheet/885012206046.pdf; ComponentLink2Description: Distributor Link; ComponentLink2URL: https://www.mouser.es/ProductDetail/Wurth-Elektronik/885012206046?qs=0KOYDY2FL2%252B89gr6HvTBXA%3D%3D; ID: 001-0112; Distributor PN: 710-885012206046; Distributor: Mouser
C502 = 001-0110: as C202 on sheet Power_Line_3V3; ComponentLink1Description: Datasheet; ComponentLink1URL: https://www.we-online.com/components/products/datasheet/885012206052.pdf; ComponentLink2Description: Distributor Link; ComponentLink2URL: https://www.mouser.es/ProductDetail/Wurth-Elektronik/885012206052?qs=0KOYDY2FL2%2F2JKabApojcQ%3D%3D; ID: 001-0110; Distributor PN: 710-885012206052; Distributor: Mouser
IC500 = 050-0002: as IC301 on sheet Power_Line_5V; ComponentLink1Description: Datasheet; ComponentLink1URL: https://www.st.com/resource/en/datasheet/vn7007ah.pdf; ComponentLink2Description: Distributor Link; ComponentLink2URL: https://www.mouser.es/ProductDetail/STMicroelectronics/VN7007AHTR?qs=mKNKSX85ZJecQmIqUrqpTA%3D%3D; ID: 050-0002; Value: -; Package: Octapak-7; MPN: VN7007AHTR; Distributor PN: STMicroelectronics; Distributor: Mouser
IC501 = 050-0001: as IC201 on sheet Power_Line_3V3; ComponentLink1Description: Datasheet; ComponentLink1URL: https://www.ti.com/lit/ds/symlink/ina226.pdf?ts=1772078114731&ref_url=https%253A%252F%252Fwww.ti.com%252Fproduct%252FINA226; ComponentLink2Description: Distributor Link; ComponentLink2URL: https://www.mouser.es/ProductDetail/Texas-Instruments/INA226AIDGSR?qs=tQG3bEuiOZD4quG3egR36g%3D%3D&srsltid=AfmBOopOjh8KVXQVeHwZlO8DxeOetC6-xgaoNkKslHEV4iGJ_SkIIo7K; ID: 050-0001; Value: -; Distributor PN: Texas Instruments; Distributor: Mouser
L500 = 033-0023: as L100 on sheet Master; ComponentLink1Description: Datasheet; ComponentLink1URL: https://www.vishay.com/docs/84393/vlmtg1400.pdf; ComponentLink2Description: Distributor Link; ComponentLink2URL: https://www.mouser.es/ProductDetail/Vishay-Semiconductors/VLMTG1400-GS08?qs=gt1LBUVyoHlZ6yHd8iEIzQ%3D%3D; ID: 033-0023; Package: 0603; Distributor PN: 78-VLMTG1400-GS08; Distributor: Mouser
R500 = 010-0145: as R300 on sheet Power_Line_5V; ComponentLink1Description: Datasheet; ComponentLink1URL: https://www.we-online.com/components/products/datasheet/560112116005.pdf; ComponentLink2Description: Distributor Link; ComponentLink2URL: https://www.mouser.es/ProductDetail/Wurth-Elektronik/560112116005?qs=mELouGlnn3dMVSPHwBGouA%3D%3D; Package: 0603; ID: 010-0145; Distributor PN: 710-560112116005; Distributor: Mouser
R501 R506 = 010-0145: as R101 on sheet Master; ComponentLink1Description: Datasheet; ComponentLink1URL: https://www.we-online.com/components/products/datasheet/560112116005.pdf; ComponentLink2Description: Distributor Link; ComponentLink2URL: https://www.mouser.es/ProductDetail/Wurth-Elektronik/560112116005?qs=mELouGlnn3dMVSPHwBGouA%3D%3D; ID: 010-0145; Distributor PN: 710-560112116005; Distributor: Mouser
R502 = 015-0003: as R200 on sheet Power_Line_3V3; ComponentLink1Description: Datasheet; ComponentLink1URL: https://www.mouser.es/datasheet/3/826/1/n_catalog_partition19_en.pdf; ComponentLink2Description: Distributor Link; ComponentLink2URL: https://www.mouser.es/ProductDetail/Susumu/KRL6432E-M-R007-F-T1?qs=FG09h9tFCuA5fgBuyupdEw%3D%3D; ID: 015-0003; Distributor PN: 754-KRL6432EMR007FT1; Distributor: Mouser
R503 = 010-0146: as R100 on sheet Master; ComponentLink1Description: Datasheet; ComponentLink1URL: https://www.we-online.com/components/products/datasheet/560112116032.pdf; ComponentLink2Description: Distributor Link; ComponentLink2URL: https://www.mouser.es/ProductDetail/Wurth-Elektronik/560112116032?qs=mELouGlnn3dPZZEXKb4zAQ%3D%3D; ID: 010-0146; Distributor PN: 710-560112116032; Distributor: Mouser
R504 R505 = 010-0149: as R202 on sheet Power_Line_3V3; ComponentLink1Description: Datasheet; ComponentLink1URL: https://www.we-online.com/components/products/datasheet/560112116013.pdf; ComponentLink2Description: Distributor Link; ComponentLink2URL: https://www.mouser.es/ProductDetail/Wurth-Elektronik/560112116013?qs=mELouGlnn3f7quibYlpocQ%3D%3D; ID: 010-0149; Distributor PN: 710-560112116013; Distributor: Mouser
TP501 = 110-0007: ComponentLink1URL: -; ComponentLink1Description: Datasheet; ComponentLink1URL: *; ComponentLink2Description: Distributor Link; ComponentLink2URL: -; ID: 110-0007; Value: -; Package: -; MPN: -; Manufacturer: -; Distributor PN: -; Distributor: -

## Sheet Protection_Stage.SchDoc: PDM
size A3; SheetNumber: 6; SheetTotal: 6
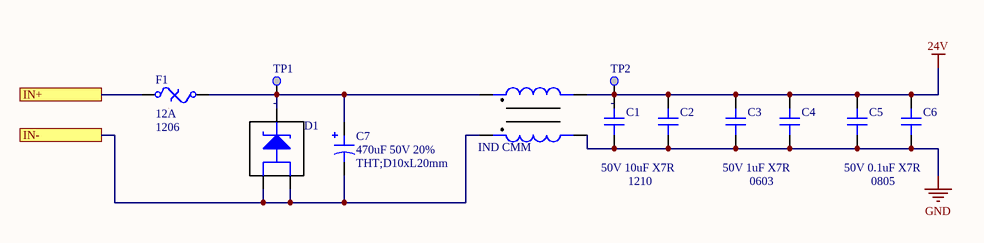
[diagram p5: Protection_Stage.SchDoc]

### Parts
C1  value 50V 10uF X7R  Package: 1210  [CAP SMD 1210]  (hidden comment: CAP non polarized)
C2  CAP non polarized  [CAP SMD 1210]  (value not drawn)
C3  value 50V 1uF X7R  Package: 0603  [CAP SMD 0603]  (hidden comment: CAP non polarized)
C4  CAP non polarized  [CAP SMD 0603]  (value not drawn)
C5  value 50V 0.1uF X7R  Package: 0805  [CAP SMD 0805]  (hidden comment: CAP non polarized)
C6  CAP non polarized  [CAP SMD 0805]  (value not drawn)
C7  value 470uF 50V 20%  Package: THT;D10xL20mm  [CAP_10Dx20L]  (hidden comment: CAP polarized)
D1  DIODE SCHOTTKY 3P  [TO-277A-3]  (value not drawn)
F1  value 12A  Package: 1206  [FUSE SMD 1206]  (hidden comment: FUSE)
L1  IND CMM  [IND_CMM_THT_10x18.5mm]
TP1  Test Point  [TP_SMD_1MM]  (value not drawn)  (no BOM)
TP2  Test Point  [TP_SMD_1MM]  (value not drawn)  (no BOM)

### Ports
IN+, IN-

### Nets
24V: C1.1 C2.1 C3.1 C4.1 C5.1 C6.1 L1.2 TP2.1
GND: C1.2 C2.2 C3.2 C4.2 C5.2 C6.2 L1.3
IN+: F1.1 ; port IN+
IN-: C7.N D1.1 D1.2 L1.4 ; port IN-
NetC7_P: C7.P D1.3 F1.2 L1.1 TP1.1

### Notes on the sheet
- Project:
- Subsystem:
- Company:
- Document:
- Author:
- Revision:
- Date:
- Sheet:
- /

### Library data of the parts
C1 = 001-0104: Condensadores de cerámica multicapa (MLCC- SMD/SMT) WCAP-CSGP 10uF 50Vol 0.1; MPN: 885012209073; Manufacturer: Wurth Elektronik; ComponentLink1Description: Datasheet; ComponentLink1URL: https://www.we-online.com/components/products/datasheet/885012209073.pdf; ComponentLink2Description: Distributor Link; ComponentLink2URL: https://www.mouser.es/ProductDetail/Wurth-Elektronik/885012209073?qs=sPbYRqrBIVm8PsM2ljQIMg%3D%3D; ID: 001-0104; Distributor PN: 710-885012209073; Distributor: Mouser
C2 = 001-0104: Condensadores de cerámica multicapa (MLCC- SMD/SMT) WCAP-CSGP 10uF 50Vol 0.1; MPN: 885012209073; Manufacturer: Wurth Elektronik; Value: 50V 10uF X7R; ComponentLink1Description: Datasheet; ComponentLink1URL: https://www.we-online.com/components/products/datasheet/885012209073.pdf; ComponentLink2Description: Distributor Link; ComponentLink2URL: https://www.mouser.es/ProductDetail/Wurth-Elektronik/885012209073?qs=sPbYRqrBIVm8PsM2ljQIMg%3D%3D; Package: 1210; ID: 001-0104; Distributor PN: 710-885012209073; Distributor: Mouser
C3 = 001-0102: Condensadores de cerámica multicapa (MLCC- SMD/SMT) WCAP-CSGP 1uF 50 Vol 10%; MPN: 885012206126; Manufacturer: Wurth Elektronik; ComponentLink1Description: Datasheet; ComponentLink1URL: https://www.we-online.com/components/products/datasheet/885012206126.pdf; ComponentLink2Description: Distributor Link; ComponentLink2URL: https://www.mouser.es/ProductDetail/Wurth-Elektronik/885012206126?qs=amGC7iS6iy%2F%252BJOLb%2FSuwig%3D%3D; ID: 001-0102; Distributor PN: 710-885012206126; Distributor: Mouser
C4 = 001-0102: Condensadores de cerámica multicapa (MLCC- SMD/SMT) WCAP-CSGP 1uF 50 Vol 10%; MPN: 885012206126; Manufacturer: Wurth Elektronik; Value: 50V 1uF X7R; ComponentLink1Description: Datasheet; ComponentLink1URL: https://www.we-online.com/components/products/datasheet/885012206126.pdf; ComponentLink2Description: Distributor Link; ComponentLink2URL: https://www.mouser.es/ProductDetail/Wurth-Elektronik/885012206126?qs=amGC7iS6iy%2F%252BJOLb%2FSuwig%3D%3D; Package: 0603; ID: 001-0102; Distributor PN: 710-885012206126; Distributor: Mouser
C5 = 001-0100: Condensadores de cerámica multicapa (MLCC- SMD/SMT) WCAP-CSGP 0.1uF 0805 10% 50V MLCC; MPN: 885012207098; Manufacturer: Wurth Elektronik; ComponentLink1Description: Datasheet; ComponentLink1URL: https://www.we-online.com/components/products/datasheet/885012207098.pdf; ComponentLink2Description: Distributor Link; ComponentLink2URL: https://www.mouser.es/ProductDetail/Wurth-Elektronik/885012207098?qs=0KOYDY2FL29sZCNyRsrK9g%3D%3D; ID: 001-0100; Distributor PN: 710-885012207098; Distributor: Mouser
C6 = 001-0100: Condensadores de cerámica multicapa (MLCC- SMD/SMT) WCAP-CSGP 0.1uF 0805 10% 50V MLCC; MPN: 885012207098; Manufacturer: Wurth Elektronik; Value: 50V 0.1uF X7R; ComponentLink1Description: Datasheet; ComponentLink1URL: https://www.we-online.com/components/products/datasheet/885012207098.pdf; ComponentLink2Description: Distributor Link; ComponentLink2URL: https://www.mouser.es/ProductDetail/Wurth-Elektronik/885012207098?qs=0KOYDY2FL29sZCNyRsrK9g%3D%3D; Package: 0805; ID: 001-0100; Distributor PN: 710-885012207098; Distributor: Mouser
C7 = 003-0001: Aluminium Electrolytic Capacitors - Radial Leaded WCAP-ATG5 470uF 50V 20% Radial; MPN: 860020675022; Manufacturer: Wurth Elektonik; ComponentLink1Description: Datasheet; ComponentLink2Description: Distributor Link; ID: 003-0001; Distributor PN: 710-860020675022; Distributor: Mouser; Datasheet: https://www.we-online.com/components/products/datasheet/860020675022.pdf; Distributor Link: https://www.mouser.es/ProductDetail/Wurth-Elektronik/860020675022?qs=0KOYDY2FL28clmrWTWQzzg%3D%3D
D1 = 031-0012: Diodos y rectificadores Schottky 20A,100VG2PSKYSMPCRect.; MPN: SS20PH102HM3/I; Manufacturer: Vishay Semiconductors; Value: 100V 20A; ComponentLink1Description: Datasheet; ComponentLink1URL: https://www.mouser.es/ProductDetail/Vishay-Semiconductors/SS20PH102HM3-I?qs=G4MbTVxgV4H1JubFDv9ZpA%3D%3D; ComponentLink2Description: Distributor Link; ComponentLink2URL: https://www.vishay.com/docs/98847/ss20ph102.pdf; ID: 031-0012; Package: TO-277A-2; Distributor PN: 78-SS20PH102HM3/I; Distributor: Mouser
F1 = 040-0026: Surface Mount Fuses 12A 32V FAST ACTING; MPN: 0501012.WRA; Manufacturer: Littelfuse; ComponentLink1Description: Datasheet; ComponentLink1URL: https://www.littelfuse.com/assetdocs/littelfuse_fuse_501a_datasheet.pdf?assetguid=16e534f2-c7ad-421d-9fb1-2d7646704d65; ComponentLink2Description: Distributor Link; ComponentLink2URL: https://www.mouser.es/en/ProductDetail/Littelfuse/0501012.WRA?qs=r5DSvlrkXmL6WmckR9m8eg%3D%3D; ID: 040-0026; Distributor PN: 576-0501012.WRA; Distributor: Mouser
L1 = 023-0001: Common Mode Chokes / Filters WE-CMB Type XXL .5mH 35A 2.3mOhm; MPN: 7448263505; Manufacturer: Wurth Elektronik; Value: 0.5mH 35A 2.3mOhm; ComponentLink1Description: Datasheet; ComponentLink1URL: *; ComponentLink2Description: Distributor Link; ComponentLink2URL: *; ID: 023-0001; Package: 47x43x23.5mm; Distributor PN: 710-7448263505; Distributor: Mouser; Datasheet: https://www.we-online.com/components/products/datasheet/7448263505.pdf; Distributor Link: https://www.mouser.es/ProductDetail/Wurth-Elektronik/7448263505?qs=2kOmHSv6VfR2wo62vNWXfg%3D%3D
TP1 TP2 = 110-0007: ComponentLink1URL: -; ComponentLink1Description: Datasheet; ComponentLink1URL: *; ComponentLink2Description: Distributor Link; ComponentLink2URL: -; ID: 110-0007; Value: -; Package: -; MPN: -; Manufacturer: -; Distributor PN: -; Distributor: -

## Nets that join several sheets
3V3: Master (IC100.3 R101.1 R102.1 TP101.1), Power_Line_3V3 (C201.2 C202.2 IC201.6 R204.1), Power_Line_5V (5 pins), RLS_Line (5 pins), AiM_Line (6 pins), Ref_Line (C501_Ref_Line.2 C502_Ref_Line.2 IC501_Ref_Line.6 R506_Ref_Line.2), IMD_Line (C501_IMD_Line.2 C502_IMD_Line.2 IC501_IMD_Line.6 R506_IMD_Line.2), BMS_Line (C501_BMS_Line.2 C502_BMS_Line.2 IC501_BMS_Line.6 R506_BMS_Line.2), INV_Line (5 pins), TSMS_Line (5 pins)
24V: Master (F100.1 R100.2 TP100.1), Power_Line_3V3 (IC200.1), Power_Line_5V (IC300.1), RLS_Line (IC400_RLS_Line.1), AiM_Line (IC400_AiM_Line.1), Ref_Line (IC500_Ref_Line.Tab), IMD_Line (IC500_IMD_Line.Tab), BMS_Line (IC500_BMS_Line.Tab), INV_Line (IC500_INV_Line.Tab), Protection_Stage (8 pins), TSMS_Line (IC500_TSMS_Line.Tab)
GND: Master (14 pins), Power_Line_3V3 (6 pins), Power_Line_5V (8 pins), RLS_Line (8 pins), AiM_Line (8 pins), Ref_Line (9 pins), IMD_Line (8 pins), BMS_Line (8 pins), INV_Line (8 pins), Protection_Stage (7 pins), TSMS_Line (8 pins)
3V3_OUT: Master (J116.3 TP114.1), Power_Line_3V3 (R200.1 R201.2 R203.2)
5V_OUT: Master (J116.2 TP113.1), Power_Line_5V (R302.1 R303.2 R305.2)
12V_OUT: Master (J101.3 TP111.1), AiM_Line (R401_AiM_Line.1 R404_AiM_Line.2 R405_AiM_Line.2)
12V_OUT: Master (J101.4 TP112.1), RLS_Line (R401_RLS_Line.1 R404_RLS_Line.2 R405_RLS_Line.2)
24V_OUT: Master (J100.6 TP105.1), Ref_Line (R502_Ref_Line.1 R503_Ref_Line.2 R505_Ref_Line.2)
24V_OUT: Master (J100.7 TP107.1), TSMS_Line (R502_TSMS_Line.1 R503_TSMS_Line.2 R505_TSMS_Line.2)
24V_OUT: Master (J100.8 TP108.1), IMD_Line (R502_IMD_Line.1 R503_IMD_Line.2 R505_IMD_Line.2)
24V_OUT: Master (J100.9 TP109.1), BMS_Line (R502_BMS_Line.1 R503_BMS_Line.2 R505_BMS_Line.2)
24V_OUT: Master (J100.10 TP110.1), INV_Line (R502_INV_Line.1 R503_INV_Line.2 R505_INV_Line.2)
IN+: Master (J109.2 TP115.1), Protection_Stage (F1.1)
IN-: Master (J109.1 TP116.1), Protection_Stage (C7.N D1.1 D1.2 L1.4)
SCL: Master (J116.5 R104.1), Power_Line_3V3 (IC201.5), Power_Line_5V (IC302.2 IC302.5), RLS_Line (IC402_RLS_Line.5), AiM_Line (IC402_AiM_Line.5), Ref_Line (IC501_Ref_Line.5), IMD_Line (IC501_IMD_Line.5), BMS_Line (IC501_BMS_Line.2 IC501_BMS_Line.5), INV_Line (IC501_INV_Line.5), TSMS_Line (IC501_TSMS_Line.5)
SDA: Master (J116.6 R103.1), Power_Line_3V3 (IC201.1 IC201.4), Power_Line_5V (IC302.4), RLS_Line (IC402_RLS_Line.2 IC402_RLS_Line.4), AiM_Line (IC402_AiM_Line.4), Ref_Line (IC501_Ref_Line.4), IMD_Line (IC501_IMD_Line.2 IC501_IMD_Line.4), BMS_Line (IC501_BMS_Line.4), INV_Line (IC501_INV_Line.4), TSMS_Line (IC501_TSMS_Line.4)

## Assembly variants
Desarrollo: not fitted IC100